# EasyEDA schematic SCH_rhythm-pad_2026-10-07.json
TITLE: Sheet_1; REV: 1.0; Date: 2026-09-05; Sheet: 1/1; Drawn By: kirbyy; Company: Your Company
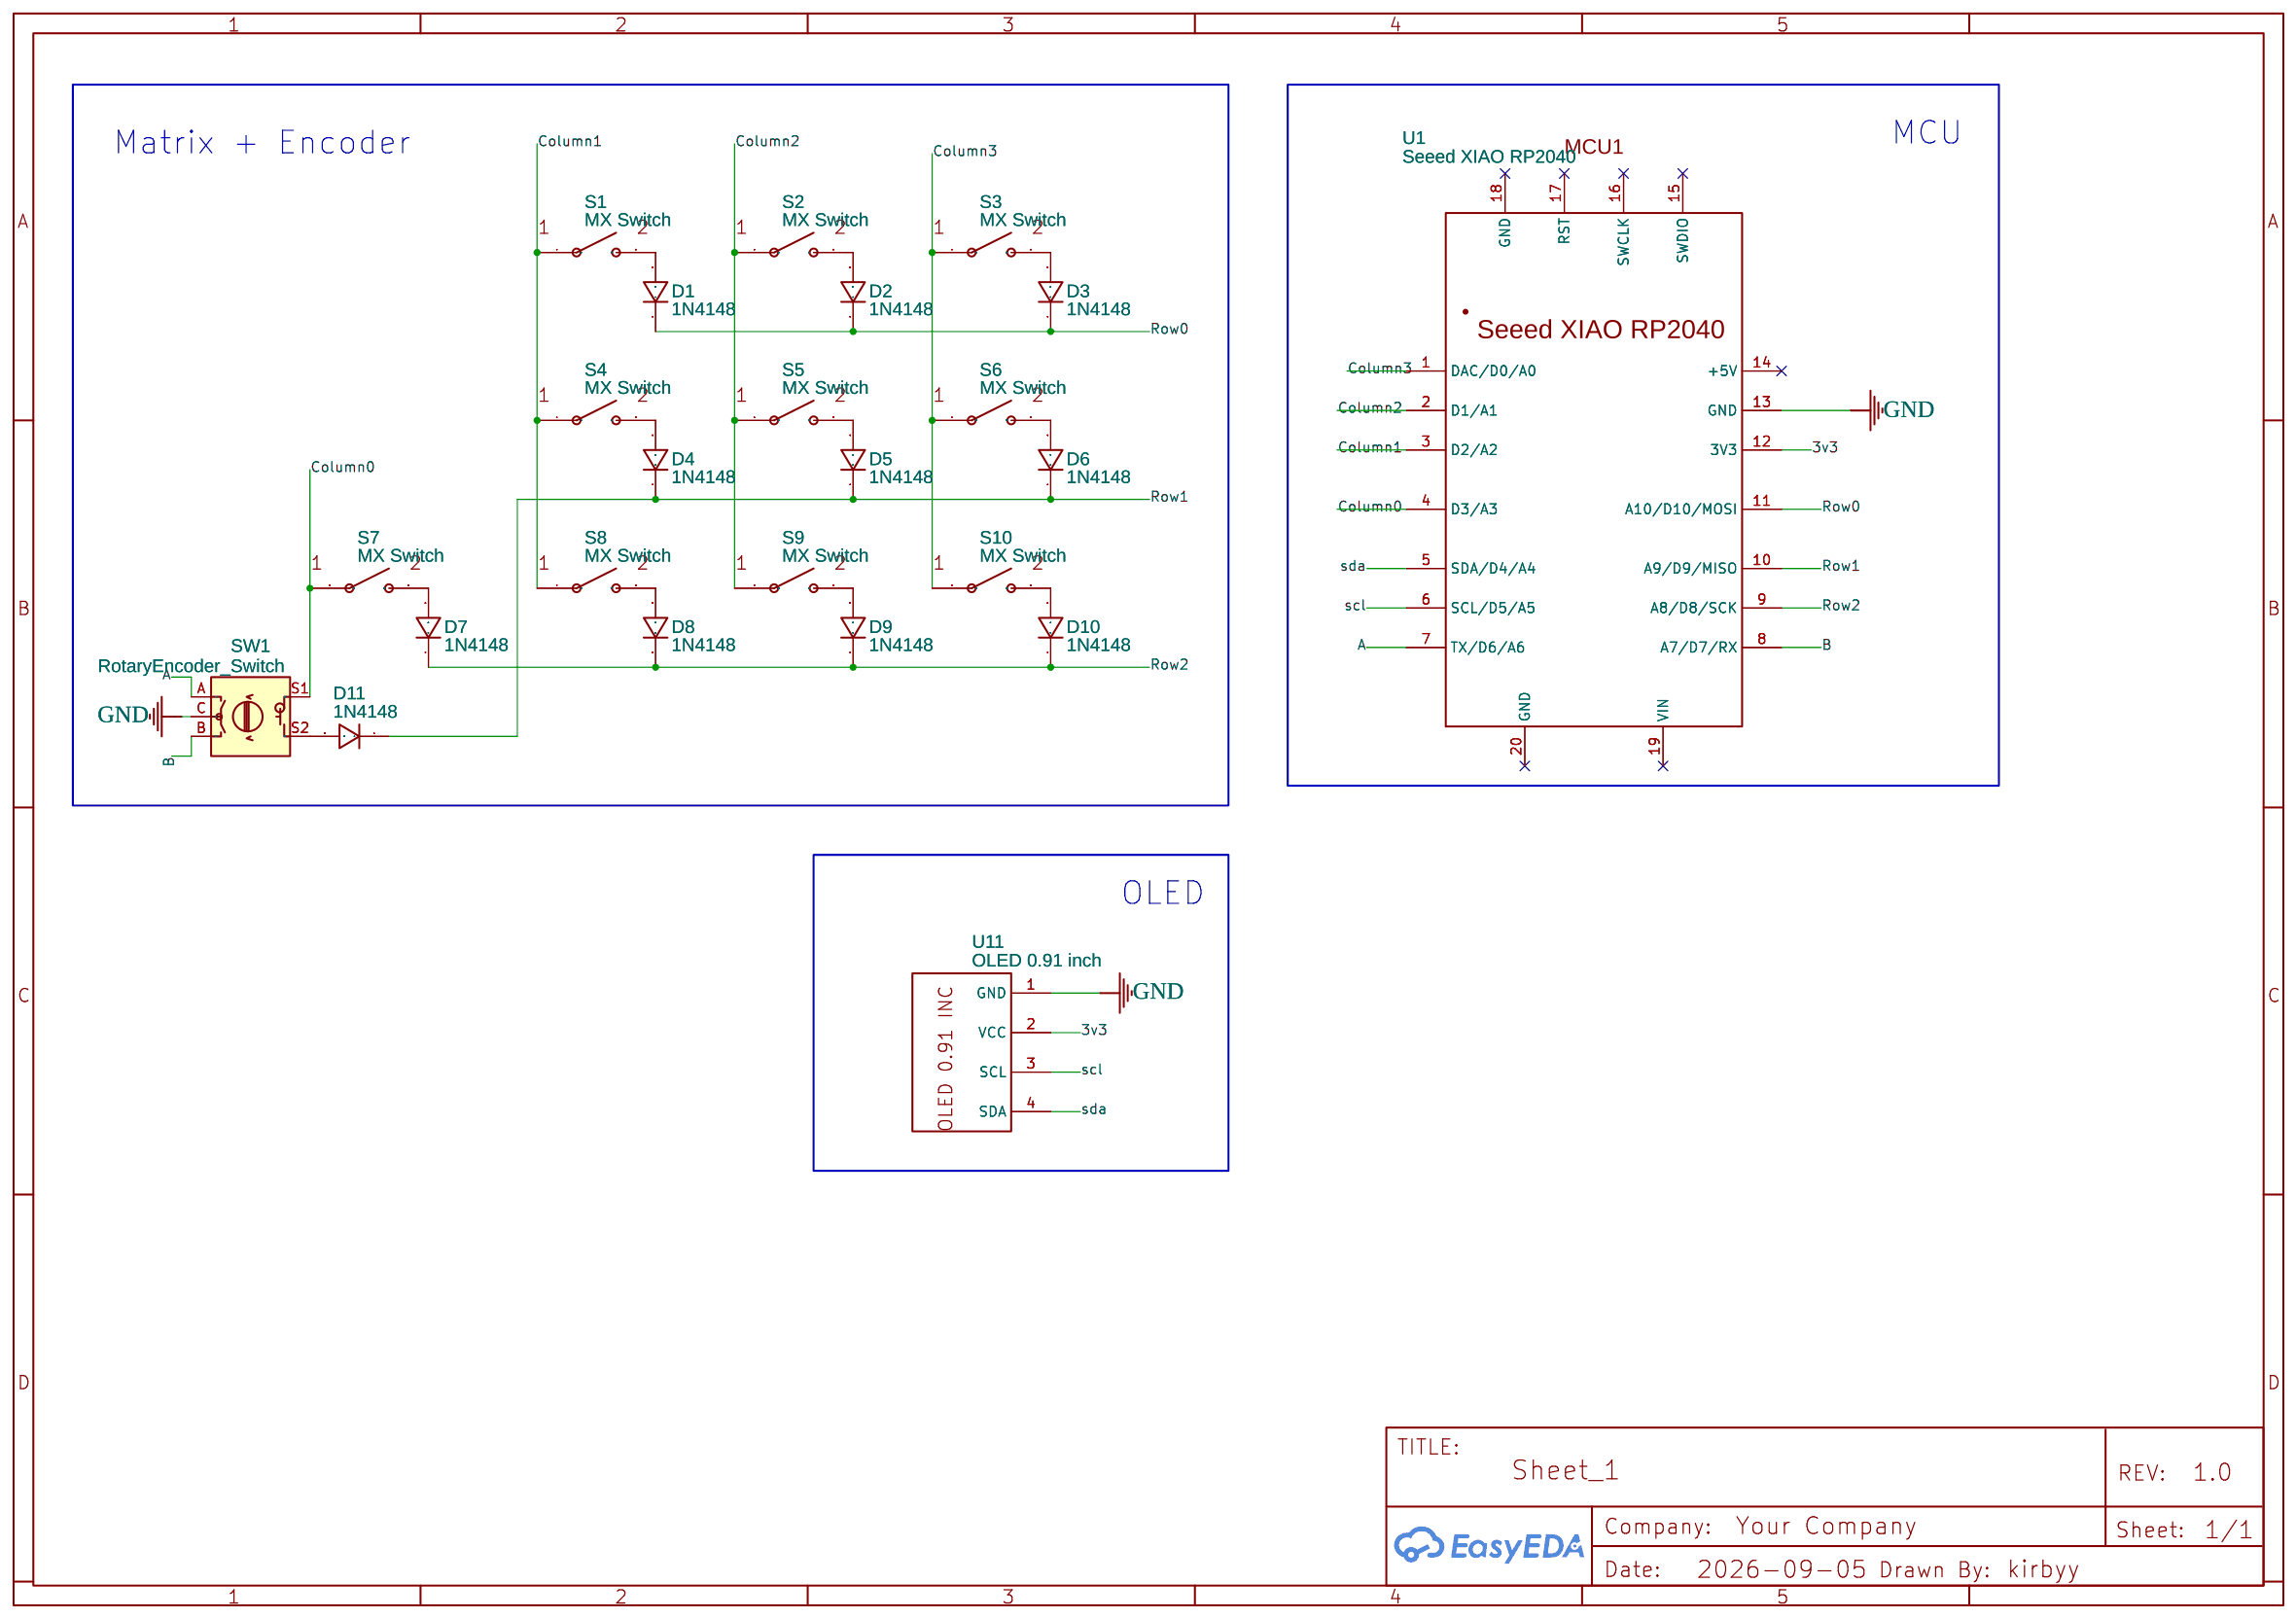
[diagram p0: schematic sheet]

## Parts
D1  1N4148  [DO-35_BD2.0-L4.2-P8.20-D0.5-RD]
D2  1N4148  [DO-35_BD2.0-L4.2-P8.20-D0.5-RD]
D3  1N4148  [DO-35_BD2.0-L4.2-P8.20-D0.5-RD]
D4  1N4148  [DO-35_BD2.0-L4.2-P8.20-D0.5-RD]
D5  1N4148  [DO-35_BD2.0-L4.2-P8.20-D0.5-RD]
D6  1N4148  [DO-35_BD2.0-L4.2-P8.20-D0.5-RD]
D7  1N4148  [DO-35_BD2.0-L4.2-P8.20-D0.5-RD]
D8  1N4148  [DO-35_BD2.0-L4.2-P8.20-D0.5-RD]
D9  1N4148  [DO-35_BD2.0-L4.2-P8.20-D0.5-RD]
D10  1N4148  [DO-35_BD2.0-L4.2-P8.20-D0.5-RD]
D11  1N4148  [DO-35_BD2.0-L4.2-P8.20-D0.5-RD]
S1  MX Switch  [CHERRY MX KEYSWITCH]
S2  MX Switch  [CHERRY MX KEYSWITCH]
S3  MX Switch  [CHERRY MX KEYSWITCH]
S4  MX Switch  [CHERRY MX KEYSWITCH]
S5  MX Switch  [CHERRY MX KEYSWITCH]
S6  MX Switch  [CHERRY MX KEYSWITCH]
S7  MX Switch  [CHERRY MX KEYSWITCH]
S8  MX Switch  [CHERRY MX KEYSWITCH]
S9  MX Switch  [CHERRY MX KEYSWITCH]
S10  MX Switch  [CHERRY MX KEYSWITCH]
SW1  RotaryEncoder_Switch  [ROTARYENCODER_ALPS_EC11E-SWITCH_VERTICAL_H20MM]
U1  Seeed XIAO RP2040  [SEEED XIAO RP2040]
U11  OLED 0.91 inch  [OLED 0.91 INCH]

## Library data of the parts
D1-D11 = 1N4148: Supplier: LCSC; Supplier Part: C13769; Manufacturer: STMicroelectronics; Contributor: LCSC
S1-S10 = Cherry MX Mechanical Keyboard Switch: Contributor: baek.s.h33
SW1 = RotaryEncoder_Switch: Comment: EC11E; Contributor: chris1414
U1 = Seeed XIAO RP2040: Manufacturer Part: Seeed XIAO RP2040(; link: https://www.seeedstudio.com/Seeeduino-XIAO-Arduino-Microcontroller-SAMD21-Cortex-M0+-p-4426.html; Contributor: mikhail_k
U11 = OLED 0.91 inch: Contributor: claudiu2001

## Nets
3v3: U1.12(3V3) U11.2(VCC)
GND: SW1.C U1.13(GND) U11.1(GND)
A: SW1.A U1.7(TX/D6/A6)
B: SW1.B U1.8(A7/D7/RX)
Column0: S7.1 SW1.S1 U1.4(D3/A3)
Column1: S1.1 S4.1 S8.1 U1.3(D2/A2)
Column2: S2.1 S5.1 S9.1 U1.2(D1/A1)
Column3: S3.1 S6.1 S10.1 U1.1(DAC/D0/A0)
Row0: D1.1 D2.1 D3.1 U1.11(A10/D10/MOSI)
Row1: D4.1 D5.1 D6.1 D11.1 U1.10(A9/D9/MISO)
Row2: D7.1 D8.1 D9.1 D10.1 U1.9(A8/D8/SCK)
scl: U1.6(SCL/D5/A5) U11.3(SCL)
sda: U1.5(SDA/D4/A4) U11.4(SDA)
Net-(D1-2): D1.2 S1.2
Net-(D2-2): D2.2 S2.2
Net-(D3-2): D3.2 S3.2
Net-(D4-2): D4.2 S4.2
Net-(D5-2): D5.2 S5.2
Net-(D6-2): D6.2 S6.2
Net-(D7-2): D7.2 S7.2
Net-(D8-2): D8.2 S8.2
Net-(D9-2): D9.2 S9.2
Net-(D10-2): D10.2 S10.2
Net-(D11-2): D11.2 SW1.S2

Not connected (* = marked no-connect by the designer): U1 14(+5V)* 15(SWDIO)* 16(SWCLK)* 17(RST)* 18(GND)* 19(VIN)* 20(GND)*

## Notes on the sheet
- Matrix + Encoder
- MCU
- OLED
